# EasyEDA Pro project Main.eprj, board Teensy4.1
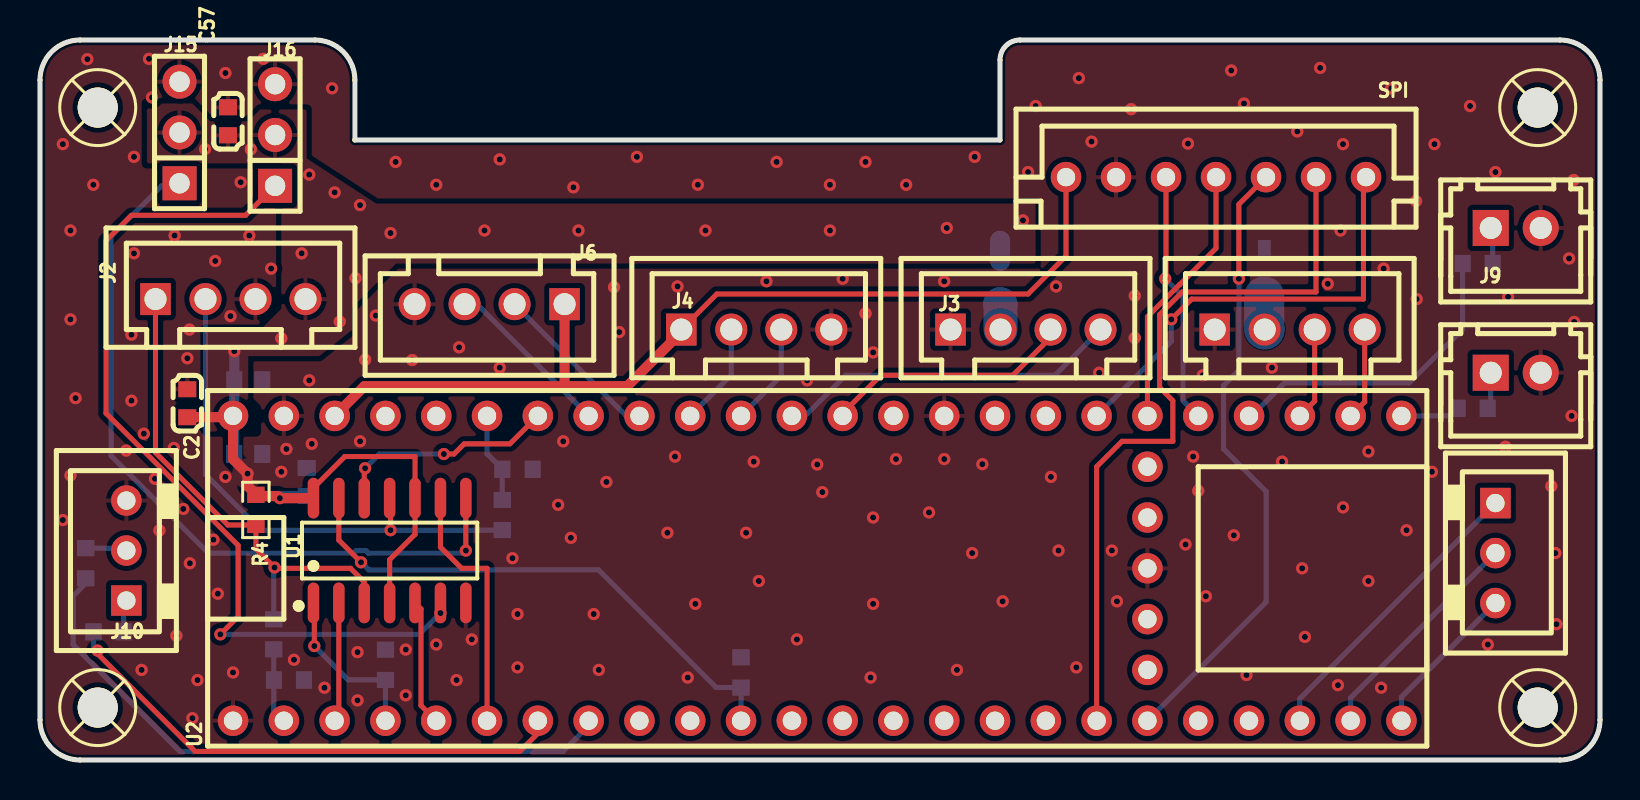
[diagram p10: board, top side]
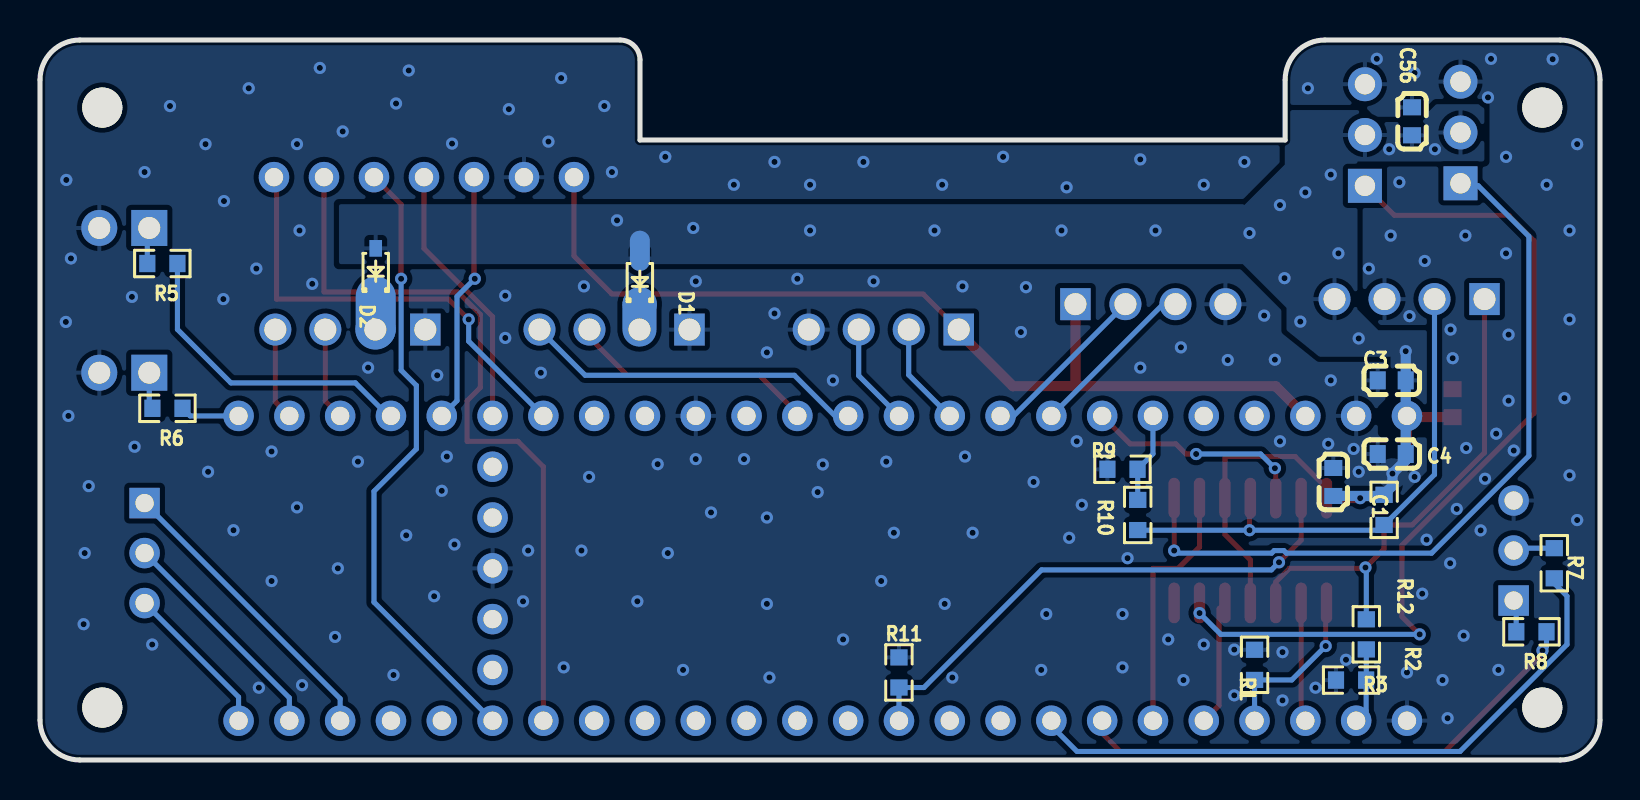
[diagram p11: board, bottom side, seen from below]

Outline 78 x 36 mm; copper layers: Top Layer, Bottom Layer. Coordinates in mm from the lower left corner of the outline.
Outline path: 0,34 0,2 arc(0.59,0.59) 2,0 76,0 arc(77.41,0.59) 78,2 78,34 arc(77.41,35.41) 76,36 49,36 arc(48.29,35.71) 48,35 48,31 15.74,31 15.74,34 arc(15.16,35.41) 13.74,36 2,36 arc(0.59,35.41) 0,34
Stack: Top Layer 0.035mm / Dielectric1 1.51mm FR4 er 4.5 / Bottom Layer 0.035mm

## Design rules (mm)
template: Custom Config
spacing copperThickness1oz (default): track to track 0.102, other pairs 0.152 to 0.3
spacing copperThickness2oz: track to track 0.203, other pairs 0.152 to 0.3
track width copperThickness1oz (default): min 0.127, default 0.254, max 7
track width copperThickness2oz: min 0.203, default 0.254, max 7
differential pair differentialPair (default): width min 0.127, default 0.254, max 2.54; gap min 0.152, default 0.152
via viaSize (default): diameter min 0.5, default 0.61, max 10; hole min 0.3, default 0.305, max 6.3

## Placement (name value [footprint] x y rotation side)
C1  100nF  [C0603]  13.33 13.9 270 bottom
C2  22uF  [C0603]  7.37 17.84 90 top
C3  1uF  [C0603]  10.41 18.98 0 bottom
C4  100nF  [C0603]  10.41 15.3 0 bottom
C56  100uF  [C0603]  9.4 31.94 270 bottom
C57  100uF  [C0603]  9.4 31.94 270 top
D1  BAT60B  [SOD-323_L1.7-W1.3-LS2.6-RD-1]  48.01 23.94 90 bottom
D2  BAT60B  [SOD-323_L1.7-W1.3-LS2.6-RD-1]  61.21 24.44 90 bottom
J2  POW\  [CONN-TH_4P-P2.50_4PIN]  9.53 23.05 0 top
J3  UART3  [CONN-TH_4P-P2.50_4PIN]  49.28 21.52 0 top
J4  I2C0  [CONN-TH_4P-P2.50_4PIN]  35.81 21.52 0 top
J6  I2C1  [CONN-TH_4P-P2.50_4PIN]  22.48 22.79 180 top
J8  touch0  [CONN-TH_2P-P2.50_HX25003-2A]  73.79 19.36 0 top
J9  touch1  [CONN-TH_2P-P2.50_HX25003-2A]  73.79 26.6 0 top
J10  cnduct  [CONN-TH_3P-P2.50_BX-XH2.54-3PZZ]  4.32 10.47 90 top
J15  PZ254V-11-03P  [HDR-TH_3P-P2.54-V-M_PZ254V-11-03P]  6.98 31.38 90 top
J16  PZ254V-11-03P  [HDR-TH_3P-P2.54-V-M_PZ254V-11-03P]  11.75 31.25 90 top
J17  ToF-CS  [CONN-TH_3P-P2.50_BX-XH2.54-3PZZ]  72.77 10.35 270 top
J18  K230  [CONN-TH_4P-P2.50_4PIN]  62.48 21.52 0 top
R1  10kΩ  [R0603]  17.27 4.76 270 bottom
R2  3.3kΩ  [R0603]  11.68 6.28 90 bottom
R3  4.7kΩ  [R0603]  12.45 4 0 bottom
R4  2.2kΩ  [R0603]  10.8 12.5 90 top
R5  1kΩ  [R0603]  71.88 24.82 180 bottom
R6  1kΩ  [R0603]  71.63 17.58 180 bottom
R7  1kΩ  [R0603]  2.29 9.84 270 bottom
R8  1kΩ  [R0603]  3.43 6.41 180 bottom
R9  4.7kΩ  [R0603]  23.88 14.54 0 bottom
R10  3.3kΩ  [R0603]  23.11 12.25 270 bottom
R11  10kΩ  [R0603]  35.05 4.38 270 bottom
R12  2.2kΩ  [R0603]  10.8 12.5 90 bottom
SCREW1  -  [Screw-Hole-M2]  2.89 32.62 0 top
SCREW2  -  [Screw-Hole-M2]  2.89 2.62 0 top
SCREW3  -  [Screw-Hole-M2]  74.89 32.62 0 top
SCREW4  -  [Screw-Hole-M2]  74.89 2.62 0 top
SPI  ZX-XH2.54-7PZZ  [CONN-TH_7P-P2.50_ZX-XH2.54-7PZZ]  58.8 29.14 180 top
U1  CD74HCT126M96  [SOIC-14_L8.7-W3.9-P1.27-LS6.0-BL]  17.48 10.47 0 top
U2  -  [TEENSY 4.1]  40 9.58 90 top

## Footprints (pads in the part's own frame, mm; a bottom-side part is the same pattern mirrored in y, then rotated)
C0603
  rect 0.8x0.9 smd: 1(-0.7,0) 2(0.7,0)
CONN-TH_2P-P2.50_HX25003-2A
  rect 1.8x1.8 hole 1.1: 1(-1.25,0)
  round 1.8 hole 1.1: 2(1.25,0)
CONN-TH_3P-P2.50_BX-XH2.54-3PZZ
  rect 1.524x1.524 hole 0.914: 1(-2.5,0)
  round 1.524 hole 0.914: 2(0,0) 3(2.5,0)
CONN-TH_4P-P2.50_4PIN
  rect 1.524x1.6 hole 1.1: 1(-3.75,0)
  round 1.6 hole 1.1: 2(-1.25,0) 3(1.25,0) 4(3.75,0)
CONN-TH_7P-P2.50_ZX-XH2.54-7PZZ
  round 1.524 hole 0.914: 1(7.5,0) 2(5,0) 3(2.5,0) 4(0,0) 5(-2.5,0) 6(-5,0) 7(-7.5,0)
HDR-TH_3P-P2.54-V-M_PZ254V-11-03P
  rect 1.7x1.7 hole 1.02: 1(-2.54,0)
  round 1.7 hole 1.02: 2(0,0) 3(2.54,0)
R0603
  rect 0.806x0.864 smd: 1(-0.753,0) 2(0.753,0)
Screw-Hole-M2
  round 2 hole 2: 1(0,0)
SOD-323_L1.7-W1.3-LS2.6-RD-1
  rect 0.83x0.63 smd: 1(-1.14,0) 2(1.14,0)
SOIC-14_L8.7-W3.9-P1.27-LS6.0-BL
  oval 0.574x2.038 smd: 1(-3.81,-2.619) 2(-2.54,-2.619) 3(-1.27,-2.619) 4(0,-2.619) 5(1.27,-2.619) 6(2.54,-2.619) 7(3.81,-2.619) 8(3.81,2.619) 9(2.54,2.619) 10(1.27,2.619) 11(0,2.619) 12(-1.27,2.619) 13(-2.54,2.619) 14(-3.81,2.619)
TEENSY 4.1
  round 1.524 hole 0.914: 1(-7.62,30.353) 2(-7.62,27.813) 3(-7.62,25.273) 4(-7.62,22.733) 5(-7.62,20.193) 6(-7.62,17.653) 7(-7.62,15.113) 8(-7.62,12.573) 9(-7.62,10.033) 10(-7.62,7.493) 11(-7.62,4.953) 12(-7.62,2.413) 13(-7.62,-0.127) 14(-7.62,-2.667) 15(-7.62,-5.207) 16(-7.62,-7.747) 17(-7.62,-10.287) 18(-7.62,-12.827) 19(-7.62,-15.367) 20(-7.62,-17.907) 21(-7.62,-20.447) 22(-7.62,-22.987) 23(-7.62,-25.527) 24(-7.62,-28.067) 25(7.62,30.353) 26(7.62,27.813) 27(7.62,25.273) 28(7.62,22.733) 29(7.62,20.193) 30(7.62,17.653) 31(7.62,15.113) 32(7.62,12.573) 33(7.62,10.033) 34(7.62,7.493) 35(7.62,4.953) 36(7.62,2.413) 37(7.62,-0.127) 38(7.62,-2.667) 39(7.62,-5.207) 40(7.62,-7.747) 41(7.62,-10.287) 42(7.62,-12.827) 43(7.62,-15.367) 44(7.62,-17.907) 45(7.62,-20.447) 46(7.62,-22.987) 47(7.62,-25.527) 48(7.62,-28.067) 49(5.08,-15.367) 50(2.54,-15.367) 51(0,-15.367) 52(-2.54,-15.367) 53(-5.08,-15.367)

## Nets
As in the schematic, except:
+3.3V: J4.1 J6.1 SPI.1 U2.27
CS1: SPI.4 U2.43
MOSI1: SPI.6 U2.18
POWER_GND: C1.1 C2.2 C3.2 C4.2 C56.1 C57.1 J2.3 J3.1 J4.4 J6.4 J8.2 J9.2 J10.3 J15.3 J16.3 J18.1 R1.1 R3.2 R9.2 R11.1 SPI.2 U1.7 U2.1 U2.26 U2.39 U2.51
TEENSY_TX8: J18.3 U2.46

Pads without a net: SCREW1 1; SCREW2 1; SCREW3 1; SCREW4 1; U2 12 13 14 15 20 21 28 29 38 40 41 49 52 53

## Via types
v1: diameter 0.61, hole 0.305, Top Layer to Bottom Layer, 197 vias

## Routing (per net, layer and track width the routed paths; a pad name or vN(x,y) marks a point on that pad's centre or on a via; arc(x,y) is an arc through that point)
+3.3V: length 48
  Top Layer w0.254: SPI.1 51.3,25.2 49.4,23.3 33.84,23.3 J4.1
  Top Layer w0.508: U2.27 16.22,18.69 26.23,18.69 ; J6.1 26.23,18.69 ; 26.23,18.69 29.36,18.69 32.06,21.39 J4.1
+5V: length 35.1
  Top Layer w0.254: U1.4 17.48,10.01 18.75,11.28 U1.10 18.75,15.17 15.24,15.17 13.67,13.6 U1.14
  Top Layer w0.508: 7.24,17.14 9.59,17.14 U2.25 9.65,15.05 v1(10.38,14.32) 10.38,13.7 10.89,13.19 11.89,13.19 v1(11.99,13.09) U1.14
  Bottom Layer w0.508: v1(9.71,20.44) C3.1 9.71,17.27 U2.25 9.71,17.14 C4.1 9.71,14.98 v1(10.38,14.32) 10.38,13.71 10.89,13.2 C1.2
  Bottom Layer w1: 48.01,24.95 48.01,25.97
  vias: v1(8.25,30.54) v1(10.54,30.54) v1(12.06,21.08) v1(13.08,25.33) v1(13.46,29.27) v1(14.73,28.38) v1(14.99,21.92) v1(15.78,24.09) v1(16,27.75) v1(17.53,26.35) v1(22.22,26.47) v1(26.92,26.47) v1(33.27,26.47) v1(39.5,26.47) v1(45.34,26.6) v1(49.15,26.98)
CS1: length 13.4
  Top Layer w0.254: U2.43 55.37,22.17 56.96,23.76 56.97,23.76 58.8,25.59 SPI.4
HS45HB-0_SIGNAL: length 38
  Top Layer w0.254: U1.8 v1(21.29,10.47)
  Bottom Layer w0.254: v1(21.29,10.47) 21.17,10.34 16.42,10.34 16.29,10.47 15.81,10.47 15.68,10.34 8.42,10.34 3.56,15.21 3.56,26.18 6.09,28.71 6.85,28.71 J15.1
HS45HB-1_SIGNAL: length 43.8
  Top Layer w0.254: J16.1 10.28,27.24 4.57,27.24 3.3,25.97 3.3,17.34 9.91,10.73 9.91,7.17 v1(9.02,6.28)
  Bottom Layer w0.254: v1(20.02,7.35) 18.96,6.28 v1(9.02,6.28)
INT1: length 12.6
  Top Layer w0.254: v1(56.26,24.06) 56.3,24.1 SPI.3
  Bottom Layer w0.254: v1(56.26,24.06) 57.15,23.17 57.15,17.97 U2.44
KRS3301_SIGNAL: length 25.1
  Top Layer w0.254: U1.3 16.21,8.9 15.53,9.58 11.77,9.58 v1(11.73,9.62) 10.8,10.56 R4.1 9.39,11.75 5.78,15.37 J2.1
  Bottom Layer w0.254: R2.2 11.68,9.58 v1(11.73,9.62)
MISO1: length 22.6
  Top Layer w0.254: v1(56.57,22.03) 57.58,23.05 66.17,23.05 66.17,29.02 SPI.7
  Bottom Layer w0.254: v1(56.57,22.03) 56.57,20.94 U2.42
MOSI1: length 37.7
  Top Layer w0.254: SPI.6 63.8,23.4 57.11,23.4 55.98,22.27 55.98,18.63 56.64,17.97 56.64,15.93 54.1,15.93 52.83,14.66 U2.18
POWER_GND:
  vias: v1(1.14,30.79) v1(1.14,12) v1(1.52,26.47) v1(1.52,22.03) v1(1.52,14.23) v1(1.78,18.09) v1(2.37,35.04) v1(2.67,28.76) v1(4.31,15.47) v1(4.57,21.27) v1(4.57,17.97) v1(4.7,30.16) v1(4.7,25.33) v1(5.08,4.5) v1(5.19,16.31) v1(5.45,35.06) v1(5.6,33.13) v1(5.75,14.06) v1(5.97,11.48) v1(6.73,26.22) v1(6.69,15.6) v1(6.82,6.22) v1(7.16,12.55) v1(7.37,20.09) v1(7.47,21.52) v1(7.49,9.84) v1(7.62,2.09) v1(7.87,4) v1(8.67,11.02) v1(8.76,24.95) v1(8.89,8.31) v1(9.27,34.35) v1(9.27,14.16) v1(9.53,22.19) v1(9.65,4.38) v1(10.03,28.89) v1(10.47,26.22) v1(11.16,35.06) v1(11.56,24.57) v1(12.06,14.41) v1(12.32,15.55) v1(12.7,5.01) v1(13.46,18.98) v1(13.59,15.81) v1(14.22,3.61) v1(14.61,33.59) v1(15.88,5.39) v1(15.88,2.98) v1(16,15.93) v1(16.26,20.02) v1(16.79,22.22) v1(17.78,29.9) v1(18.29,5.52) v1(18.29,3.23) v1(18.61,20) v1(19.81,28.76) v1(19.81,5.77) v1(20.83,4) v1(20.96,20.63) v1(21.59,6.03) v1(22.99,30.03) v1(22.99,19.62) v1(23.62,10.09) v1(23.88,7.3) v1(23.88,4.63) v1(25.91,12.76) v1(26.16,15.93) v1(26.54,11.11) v1(26.67,28.63) v1(27.69,7.3) v1(27.94,4.5) v1(28.32,13.9) v1(28.7,23.64) v1(28.96,21.39) v1(29.84,30.16) v1(31.37,11.36) v1(31.75,15.17) v1(31.88,23.68) v1(32.38,4.12) v1(32.77,7.81) v1(32.89,28.76) v1(35.31,11.36) v1(35.69,14.92) v1(35.94,8.95) v1(36.32,23.94) v1(36.83,29.9) v1(37.85,6.03) v1(38.35,18.98) v1(38.86,14.78) v1(39.12,13.39) v1(39.5,28.76) v1(40.13,24.06) v1(41.28,29.9) v1(41.28,22.33) v1(41.53,4.12) v1(41.66,20.38) v1(41.66,12.12) v1(41.66,7.81) v1(42.8,15.05) v1(43.31,28.76) v1(44.45,12.38) v1(45.21,23.94) v1(45.21,15.05) v1(45.85,4.5) v1(46.61,10.35) v1(46.74,30.16) v1(47.12,14.79) v1(48.13,7.93) v1(49.4,29.4) v1(49.78,32.7) v1(50.55,14.16) v1(50.8,23.68) v1(50.93,10.47) v1(51.82,4.63) v1(51.94,34.09) v1(52.58,30.92) v1(52.96,19.36) v1(53.59,10.47) v1(53.85,7.93) v1(54.56,32.54) v1(54.74,23.21) v1(54.74,21.1) v1(57.28,10.78) v1(57.4,30.82) v1(57.66,15.17) v1(57.91,13.46) v1(58.14,19.24) v1(58.29,8.19) v1(59.56,34.48) v1(59.69,11.23) v1(60.2,32.83) v1(60.32,4.25) v1(61.59,19.62) v1(62.1,14.92) v1(62.87,31.43) v1(63.11,9.58) v1(63.25,6.16) v1(64.01,34.6) v1(64.39,23.81) v1(64.9,3.74) v1(65.02,26.47) v1(65.15,30.79) v1(65.15,12.63) v1(66.42,15.43) v1(66.42,8.95) v1(67.06,3.61) v1(67.18,24.57) v1(67.56,33.59) v1(68.33,11.49) v1(68.8,27.95) v1(68.83,23.05) v1(69.6,14.41) v1(69.72,30.79) v1(71.5,32.7) v1(72.39,5.77) v1(72.77,29.4) v1(73.27,15.66) v1(73.4,23.16) v1(75.56,13.69) v1(75.77,10.35) v1(75.82,6.79) v1(76.45,25.08) v1(76.58,17.2) v1(76.69,29) v1(76.71,21.9)
SCK1: length 31.4
  Top Layer w0.254: SPI.5 59.94,27.78 v1(59.94,24.06)
  Bottom Layer w0.254: v1(59.94,24.06) 59.94,19.49 59.18,18.73 59.18,15.55 61.3,13.43 61.3,7.89 U2.19
STS3032_SIGNAL: length 26.4
  Top Layer w0.254: U1.11 17.53,13.05 v1(17.53,11.49)
  Bottom Layer w0.254: J2.2 8.28,14.27 R12.1 11.06,11.49 v1(17.53,11.49) 23.11,11.49 R10.2
TEENSY_2: length 8.5
  Top Layer w0.254: U1.1 13.72,7.81 v1(13.72,5.7)
  Bottom Layer w0.254: v1(13.72,5.7) 15.41,4 R1.2 U2.4
TEENSY_3: length 6.3
  Top Layer w0.254: U1.5 19.05,7.56 19.05,2.73 U2.5
TEENSY_4: length 12.8
  Top Layer w0.254: U1.9 20.02,10.64 21.08,9.58 22.35,9.58 U2.6
TEENSY_5: length 26.2
  Top Layer w0.254: U2.7 24.89,1.33 23.99,0.43 7.76,0.43 2.88,5.31 v1(2.88,5.47)
  Bottom Layer w0.254: R8.2 2.68,5.67 v1(2.88,5.47)
TEENSY_6: length 32.4
  Bottom Layer w0.254: U2.8 27.43,1.71 26.15,0.43 7,0.43 1.65,5.77 1.65,8.2 2.29,8.83 R7.2
TEENSY_9: length 26.9
  Top Layer w0.254: v1(16.05,9.89) 14.94,10.99 U1.13
  Bottom Layer w0.254: v1(16.05,9.89) 16.43,9.5 27.92,9.5 33.81,3.62 R11.2 U2.11
TEENSY_30: length 14.9
  Bottom Layer w0.254: J17.1 62.99,3.07 U2.22
TEENSY_31: length 11.4
  Bottom Layer w0.254: U2.23 65.53,3.11 J17.2
TEENSY_32: length 7.8
  Bottom Layer w0.254: U2.24 68.07,3.15 J17.3
TEENSY_33: length 3
  Bottom Layer w0.254: R6.2 70.49,17.2 U2.48
TEENSY_36: length 15.8
  Bottom Layer w0.254: 60.45,17.08 62.23,18.86 68.45,18.86 71.13,21.53 R5.2
TEENSY_RX1: length 3.8
  Bottom Layer w0.254: U2.2 11.69,2.46 R3.1 11.68,4 R2.1
TEENSY_RX3: length 17.3
  Bottom Layer w0.254: 37.59,17.08 38.12,17.08 40.28,19.24 50.74,19.24 J3.4
TEENSY_RX5: length 4.5
  Bottom Layer w0.254: U2.30 22.35,15.31 R9.1 23.11,14.53 R10.1
TEENSY_RX8: length 4.6
  Top Layer w0.254: J18.4 66.23,17.91 U2.47
TEENSY_SCL-0: length 5.2
  Bottom Layer w0.254: U2.35 37.06,19.22 J4.3
TEENSY_SCL-1: length 8.5
  Bottom Layer w0.254: U2.32 21.84,22.79 J6.3
TEENSY_SDA-0: length 5.2
  Bottom Layer w0.254: J4.2 34.56,19.26 U2.34
TEENSY_SDA-1: length 8.6
  Bottom Layer w0.254: U2.33 29.32,17.2 J6.2
TEENSY_TX1: length 6
  Top Layer w0.254: U2.3 14.94,2.17 U1.2
TEENSY_TX3: length 12.6
  Top Layer w0.254: J3.3 50.53,21.12 48.64,19.24 42.04,19.24 40.13,17.33 40.13,17.08
TEENSY_TX5: length 11.2
  Top Layer w0.254: v1(20.19,15.3) 20.7,15.3 21.21,15.81 23.5,15.81 U2.31 ; U1.12 16.21,14.54 v1(16.26,14.59)
  Bottom Layer w0.254: v1(20.19,15.3) 16.97,15.3 v1(16.26,14.59)
TEENSY_TX8: length 4.6
  Top Layer w0.254: U2.46 63.73,17.95 J18.3
$1N12604: length 1.7
  Bottom Layer w0.254: R8.1 4.19,6.42 4.19,8.1
$1N12618: length 1.8
  Bottom Layer w0.254: J8.1 72.54,17.74 R6.1
$1N12632: length 1.9
  Bottom Layer w0.254: R7.1 4.18,10.59 4.19,10.6
$1N12638: length 1.8
  Bottom Layer w0.254: R5.1 72.64,26.5 J9.1
$1N65243: length 1.3
  Bottom Layer w1.7: D1.1 48.03,22.78 J3.2
$1N99968: length 1.7
  Bottom Layer w2: 61.21,23.18 61.21,21.54 J18.2

## Copper pours and planes (outline as drawn; the poured copper is in the pictures)
+5V on Top Layer: 13.33,32.53 11.01,32.53 10.41,31.94 8.51,31.94 7.62,32.83 5.34,32.83 5.34,29.83 12.06,29.83 12.06,22.56 11.03,21.52 8.28,21.52 8.28,16.53 8.38,16.42 10.8,16.42 10.8,17.58 10.41,17.97 10.41,20.19 13.97,20.19 15.62,21.52 15.62,22.64 17.8,24.82 49.78,24.82 49.78,27.82 16.81,27.82 13.33,30.08
+5V on Bottom Layer: 15.76,29.77 15.76,32.5 11.95,32.5 11.36,31.9 9.08,31.9 8.19,32.79 5.78,32.79 5.78,29.93 12.12,29.93 12.12,22.53 11.09,21.49 8.33,21.49 8.33,16.5 8.44,16.39 10.85,16.39 10.85,17.55 10.47,17.93 10.47,20.16 14.03,20.16 15.68,21.49 15.68,22.61 17.86,24.79 63.05,24.79 63.05,27.79 17.83,27.79 17.78,27.75
POWER_GND on Top Layer: -9.21,40.89 78.3,40.89 78.3,-11.82 -9.21,-11.82
POWER_GND on Bottom Layer: -7.24,42.48 80.26,42.48 80.26,-10.23 -7.24,-10.23

Small or netless copper shapes (teardrops, artwork), in the pictures only: 1 on Bottom Layer
